# Altium schematic sheet Motor3.SchDoc
size A; SheetNumber: 6; SheetTotal: 7
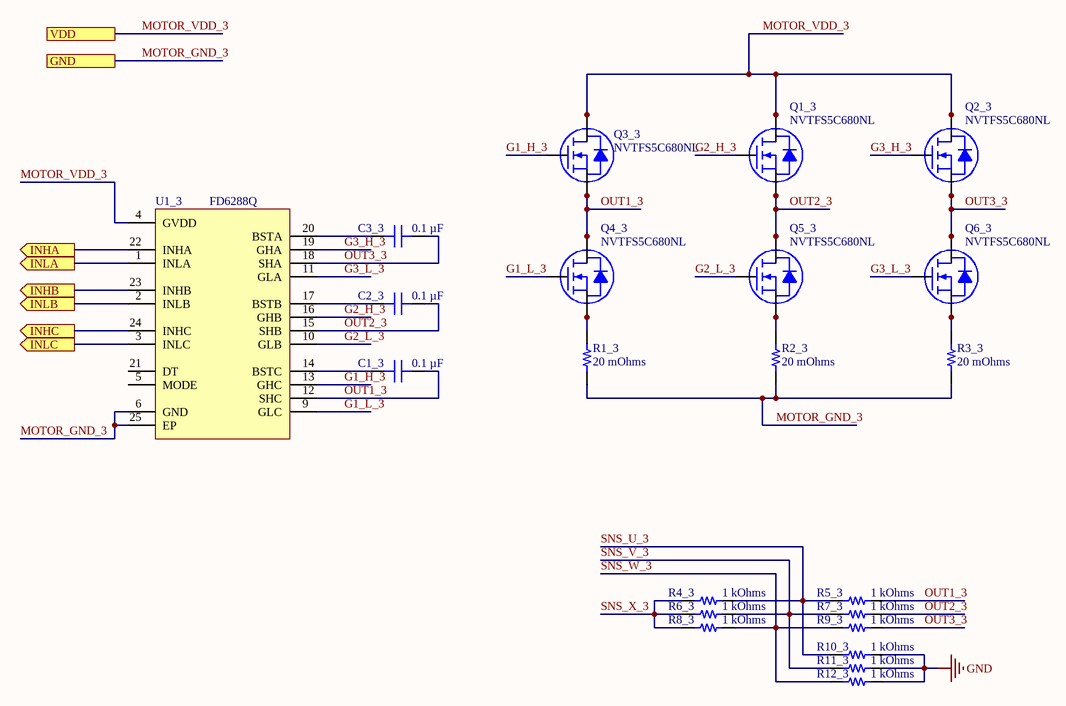
[diagram p0: Motor3.SchDoc]

## Parts
C1_3  0.1 µF  [CAP 0402_1005]
C2_3  0.1 µF  [CAP 0402_1005]
C3_3  0.1 µF  [CAP 0402_1005]
Q1_3  NVTFS5C680NL  [NVTFS015N04CTAG]
Q2_3  NVTFS5C680NL  [NVTFS015N04CTAG]
Q3_3  NVTFS5C680NL  [NVTFS015N04CTAG]
Q4_3  NVTFS5C680NL  [NVTFS015N04CTAG]
Q5_3  NVTFS5C680NL  [NVTFS015N04CTAG]
Q6_3  NVTFS5C680NL  [NVTFS015N04CTAG]
R1_3  20 mOhms  [STACKPOLE CSR0805]
R2_3  20 mOhms  [STACKPOLE CSR0805]
R3_3  20 mOhms  [STACKPOLE CSR0805]
R4_3  1 kOhms  [RES 0402_1005]
R5_3  1 kOhms  [RES 0402_1005]
R6_3  1 kOhms  [RES 0402_1005]
R7_3  1 kOhms  [RES 0402_1005]
R8_3  1 kOhms  [RES 0402_1005]
R9_3  1 kOhms  [RES 0402_1005]
R10_3  1 kOhms  [RES 0402_1005]
R11_3  1 kOhms  [RES 0402_1005]
R12_3  1 kOhms  [RES 0402_1005]
U1_3  FD6288Q  [QFN50P400X400X100-25N]

## Ports
GND, INHA (out), INHB (out), INHC (out), INLA (out), INLB (out), INLC (out), VDD

## Nets
GND: R10_3.1 R11_3.1 R12_3.1
G1_H_3: Q3_3.4(G) U1_3.13(GHC)
G1_L_3: Q4_3.4(G) U1_3.9(GLC)
G2_H_3: Q1_3.4(G) U1_3.16(GHB)
G2_L_3: Q5_3.4(G) U1_3.10(GLB)
G3_H_3: Q2_3.4(G) U1_3.19(GHA)
G3_L_3: Q6_3.4(G) U1_3.11(GLA)
INHA: U1_3.22(INHA) ; port INHA
INHB: U1_3.23(INHB) ; port INHB
INHC: U1_3.24(INHC) ; port INHC
INLA: U1_3.1(INLA) ; port INLA
INLB: U1_3.2(INLB) ; port INLB
INLC: U1_3.3(INLC) ; port INLC
MOTOR_GND_3: R1_3.1 R2_3.1 R3_3.1 U1_3.6(GND) U1_3.25(EP) ; port GND
MOTOR_VDD_3: Q1_3.5(D) Q1_3.6(D) Q1_3.7(D) Q1_3.8(D) Q2_3.5(D) Q2_3.6(D) Q2_3.7(D) Q2_3.8(D) Q3_3.5(D) Q3_3.6(D) Q3_3.7(D) Q3_3.8(D) U1_3.4(GVDD) ; port VDD
OUT1_3: C1_3.2 Q3_3.1(S) Q3_3.2(S) Q3_3.3(S) Q4_3.5(D) Q4_3.6(D) Q4_3.7(D) Q4_3.8(D) R5_3.2 U1_3.12(SHC)
OUT2_3: C2_3.2 Q1_3.1(S) Q1_3.2(S) Q1_3.3(S) Q5_3.5(D) Q5_3.6(D) Q5_3.7(D) Q5_3.8(D) R7_3.2 U1_3.15(SHB)
OUT3_3: C3_3.2 Q2_3.1(S) Q2_3.2(S) Q2_3.3(S) Q6_3.5(D) Q6_3.6(D) Q6_3.7(D) Q6_3.8(D) R9_3.2 U1_3.18(SHA)
SNS_U_3: R4_3.2 R5_3.1 R10_3.2
SNS_V_3: R6_3.2 R7_3.1 R11_3.2
SNS_W_3: R8_3.2 R9_3.1 R12_3.2
SNS_X_3: R4_3.1 R6_3.1 R8_3.1
NetC1_3_1: C1_3.1 U1_3.14(BSTC)
NetC2_3_1: C2_3.1 U1_3.17(BSTB)
NetC3_3_1: C3_3.1 U1_3.20(BSTA)
NetQ4_3_1: Q4_3.1(S) Q4_3.2(S) Q4_3.3(S) R1_3.2
NetQ5_3_1: Q5_3.1(S) Q5_3.2(S) Q5_3.3(S) R2_3.2
NetQ6_3_1: Q6_3.1(S) Q6_3.2(S) Q6_3.3(S) R3_3.2

Not connected (* = marked no-connect by the designer): U1_3 5(MODE) 21(DT)

## Library data of the parts
C1_3 C2_3 C3_3 = C0402C104K4RACAUTO: CAP CER 0.1UF 16V X7R 0402; manufacturer: KEMET; Tolerance: ±10%; Part Number: C0402C104K4RACAUTO; Value: 0.1 µF; Applications: Automotive, Bypass, Decoupling; Capacitance: 0.1 µF; componentlink1description: Datasheet; componentlink1url: https://api.kemet.com/component-edge/download/specsheet/C0402C104K4RACAUTO.pdf; componentlink2description: DigiKey Link; componentlink2url: https://www.digikey.com/en/products/detail/kemet/C0402C104K4RACAUTO/3314827; Device Package: 0402 (1005 Metric); lastupdated: 8/14/2022 9:05:51 PM; Lifecycle Status: Active; Minimum Order: 1; Mounting Type: Surface Mount, MLCC; Operating Temperature: -55°C ~ 125°C; Package / Case: 0402 (1005 Metric); packaging: TapeAndReel; partid: 3024; Part Status: Active; price: 0.01; Ratings: AEC-Q200; series: SMD Auto X7R; Size / Dimension: 0.039" L x 0.020" W (1.00mm x 0.50mm); Supplier 1: DigiKey; Supplier Part Number 1: 399-6828-1-ND; Temperature Coefficient: X7R; Thickness (Max): 0.022" (0.55mm); Voltage - Rated: 16V
Q1_3 Q2_3 Q3_3 Q4_3 Q5_3 Q6_3 = NVTFS5C680NL: N-FET
R1_3 R2_3 R3_3 = ERJ-3BWFR020V: RES 0.02 OHM 1% 1/3W 0603; Manufacturer: Panasonic Electronic Components; Power (Watts): 0.333W, 1/3W; Temperature Coefficient: ±250ppm/°C; Part Number: ERJ-3BWFR020V; Package / Case: 0603 (1608 Metric); ComponentLink1Description: Datasheet; ComponentLink1URL: https://industrial.panasonic.com/cdbs/www-data/pdf/RDN0000/AOA0000C313.pdf; ComponentLink2Description: DigiKey Link; ComponentLink2URL: https://www.digikey.com/en/products/detail/panasonic-electronic-components/ERJ-3BWFR020V/5647494; Composition: Thick Film; Device Package: 0603 (1608 Metric); Features: Automotive AEC-Q200, Current Sense; Height - Seated (Max): 0.026" (0.65mm); LastUpdated: 8/14/2022 9:50:04 PM; Lifecycle Status: Active; Minimum Order: 1; Number of Terminations: 2; Operating Temperature: -55°C ~ 155°C; Packaging: TapeAndReel; PartId: 64; Part Status: Active; Price: 0.06; Ratings: AEC-Q200; Resistance: 20 mOhms; Series: ERJ-3BW; Size / Dimension: 0.063" L x 0.031" W (1.60mm x 0.80mm); Supplier 1: DigiKey; Supplier Part Number 1: P17461CT-ND; Supplier Device Package: 0603; Tolerance: ±1%; Value: 20 mOhms
R4_3 R5_3 R6_3 R7_3 R8_3 R9_3 R10_3 R11_3 R12_3 = RK73H1ETTP1432F: RES 14.3K OHM 1% 1/10W 0402; Manufacturer: KOA Speer Electronics, Inc.; Power (Watts): 0.1W, 1/10W; Resistance: 14.3 kOhms; Temperature Coefficient: ±100ppm/°C; Part Number: RK73H1ETTP1432F; Value: 1 kOhms; ComponentLink1Description: Datasheet; ComponentLink1URL: http://www.koaspeer.com/catimages/Products/RK73H/RK73H.pdf; ComponentLink2Description: DigiKey Link; ComponentLink2URL: https://www.digikey.com/en/products/detail/koa-speer-electronics-inc/RK73H1ETTP1432F/9844351; Composition: Thick Film; Device Package: 0402 (1005 Metric); Features: Automotive AEC-Q200, Moisture Resistant; Height - Seated (Max): 0.016" (0.40mm); LastUpdated: 8/14/2022 9:23:49 PM; Lifecycle Status: Active; Minimum Order: 1; Number of Terminations: 2; Operating Temperature: -55°C ~ 155°C; Package / Case: 0402 (1005 Metric); Packaging: CutTape; PartId: 10193; Part Status: Active; Price: 0.01; Ratings: AEC-Q200; Series: RK73H; Size / Dimension: 0.039" L x 0.020" W (1.00mm x 0.50mm); Supplier 1: DigiKey; Supplier Part Number 1: 2019-RK73H1ETTP1432FCT-ND; Supplier Device Package: 0402; Tolerance: ±1%
U1_3 = FD6288Q: 3 Phase Gate Driver 1.5-2.2A; MF: Texas Instruments; MP: UCC27282DRCR; Texas_Instruments-Purchase-URL: https://snapeda.com/shop?store=Texas+Instruments&id=3625400; Price: None; Availability: Warning; Package: VSON-10 Texas Instruments; SnapEDA_Link: https://www.snapeda.com/parts/UCC27282DRCR/Texas%20Instruments/view-part/3625400/?ref=snap; DigiKey-Purchase-URL: https://snapeda.com/shop?store=DigiKey&id=3625400; Value: *